# Altium schematic sheet Memory+GPIO.SchDoc
size A4; SheetNumber: 6; SheetTotal: 6
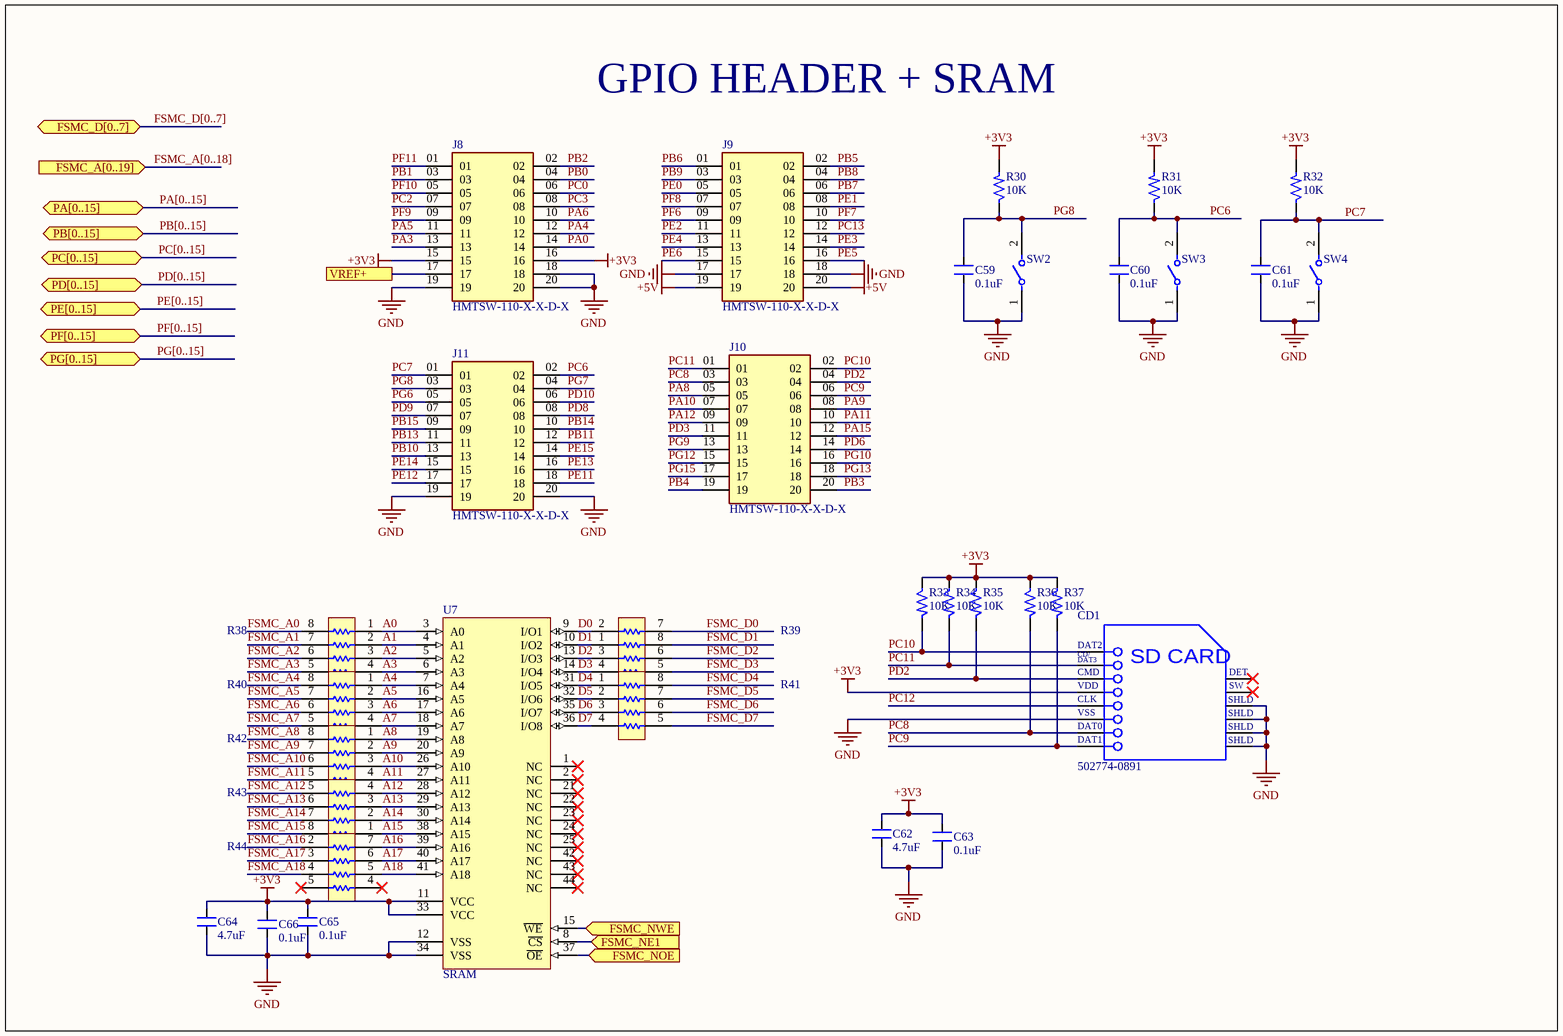
[diagram p0: Memory+GPIO.SchDoc]

## Parts
C59  0.1uF  [CAP_0805]
C60  0.1uF  [CAP_0805]
C61  0.1uF  [CAP_0805]
C62  4.7uF  [CAP_0805]
C63  0.1uF  [CAP_0805]
C64  4.7uF  [CAP_0805]
C65  0.1uF  [CAP_0805]
C66  0.1uF  [CAP_0805]
CD1  502774-0891  [MOLX-502774-0891_V]
J8  HMTSW-110-X-X-D-X  [SAMTEC_HMTSW-110-X-X-D-X]
J9  HMTSW-110-X-X-D-X  [SAMTEC_HMTSW-110-X-X-D-X]
J10  HMTSW-110-X-X-D-X  [SAMTEC_HMTSW-110-X-X-D-X]
J11  HMTSW-110-X-X-D-X  [SAMTEC_HMTSW-110-X-X-D-X]
R30  10K  [RES_0603]
R31  10K  [RES_0603]
R32  10K  [RES_0603]
R33  10K  [RES_0805]
R34  10K  [RES_0805]
R35  10K  [RES_0805]
R36  10K  [RES_0805]
R37  10K  [RES_0805]
R38  CAT16-103J4LF  [BOUR-CAT16-103J4LF_L]  (value not drawn)
R39  CAT16-103J4LF  [BOUR-CAT16-103J4LF_L]  (value not drawn)
R40  CAT16-103J4LF  [BOUR-CAT16-103J4LF_L]  (value not drawn)
R41  CAT16-103J4LF  [BOUR-CAT16-103J4LF_L]  (value not drawn)
R42  CAT16-103J4LF  [BOUR-CAT16-103J4LF_L]  (value not drawn)
R43  CAT16-103J4LF  [BOUR-CAT16-103J4LF_L]  (value not drawn)
R44  CAT16-103J4LF  [BOUR-CAT16-103J4LF_L]  (value not drawn)
SW2  147873-1  [FP-147873-1-MFG]  (value not drawn)
SW3  147873-1  [FP-147873-1-MFG]  (value not drawn)
SW4  147873-1  [FP-147873-1-MFG]  (value not drawn)
U7  SRAM  [CYP-TSOP-44_L]

## Ports
FSMC_A[0..19] (in, see MCU[3D]), FSMC_D[0..7] (bidir, see MCU[3D]), FSMC_NE1 (in, see MCU[2B]), FSMC_NOE (in, see MCU[2B]), FSMC_NWE (in, see MCU[2B]), PA[0..15] (bidir, see MCU[4D]), PB[0..15] (bidir, see MCU[4D]), PC[0..15] (bidir, see MCU[4D]), PD[0..15] (bidir, see MCU[4D]), PE[0..15] (bidir, see MCU[4D]), PF[0..15] (bidir, see MCU[4D]), PG[0..15] (bidir, see MCU[4D]), VREF+ (see MCU[3C])

## Nets
+3V3: C62.2 C63.2 C64.2 C65.2 C66.2 CD1.4(VDD) J8.15 J8.16 R30.2 R31.2 R32.2 R33.1 R34.1 R35.1 R36.1 R37.1 U7.11(VCC) U7.33(VCC)
+5V: J9.19 J9.20
GND: C59.1 C60.1 C61.1 C62.1 C63.1 C64.1 C65.1 C66.1 CD1.6(VSS) CD1.11(SHLD) CD1.12(SHLD) CD1.13(SHLD) CD1.14(SHLD) J8.18 J8.19 J8.20 J9.17 J9.18 J11.19 J11.20 SW2.1 SW3.1 SW4.1 U7.12(VSS) U7.34(VSS)
A0: R38.1 U7.3(A0)
A1: R38.2 U7.4(A1)
A2: R38.3 U7.5(A2)
A3: R38.4 U7.6(A3)
A4: R40.1 U7.7(A4)
A5: R40.2 U7.16(A5)
A6: R40.3 U7.17(A6)
A7: R40.4 U7.18(A7)
A8: R42.1 U7.19(A8)
A9: R42.2 U7.20(A9)
A10: R42.3 U7.26(A10)
A11: R42.4 U7.27(A11)
A12: R43.4 U7.28(A12)
A13: R43.3 U7.29(A13)
A14: R43.2 U7.30(A14)
A15: R43.1 U7.38(A15)
A16: R44.7 U7.39(A16)
A17: R44.6 U7.40(A17)
A18: R44.5 U7.41(A18)
D0: R39.2 U7.9(I/O1)
D1: R39.1 U7.10(I/O2)
D2: R39.3 U7.13(I/O3)
D3: R39.4 U7.14(I/O4)
D4: R41.1 U7.31(I/O5)
D5: R41.2 U7.32(I/O6)
D6: R41.3 U7.35(I/O7)
D7: R41.4 U7.36(I/O8)
FSMC_A0: R38.8
FSMC_A1: R38.7
FSMC_A2: R38.6
FSMC_A3: R38.5
FSMC_A4: R40.8
FSMC_A5: R40.7
FSMC_A6: R40.6
FSMC_A7: R40.5
FSMC_A8: R42.8
FSMC_A9: R42.7
FSMC_A10: R42.6
FSMC_A11: R42.5
FSMC_A12: R43.5
FSMC_A13: R43.6
FSMC_A14: R43.7
FSMC_A15: R43.8
FSMC_A16: R44.2
FSMC_A17: R44.3
FSMC_A18: R44.4
FSMC_D0: R39.7
FSMC_D1: R39.8
FSMC_D2: R39.6
FSMC_D3: R39.5
FSMC_D4: R41.8
FSMC_D5: R41.7
FSMC_D6: R41.6
FSMC_D7: R41.5
FSMC_NE1: U7.8(~{CS}) ; port FSMC_NE1
FSMC_NOE: U7.37(~{OE}) ; port FSMC_NOE
FSMC_NWE: U7.15(~{WE}) ; port FSMC_NWE
PA0: J8.14
PA3: J8.13
PA4: J8.12
PA5: J8.11
PA6: J8.10
PA8: J10.05
PA9: J10.08
PA10: J10.07
PA11: J10.10
PA12: J10.09
PA15: J10.12
PB0: J8.04
PB1: J8.03
PB2: J8.02
PB3: J10.20
PB4: J10.19
PB5: J9.02
PB6: J9.01
PB7: J9.06
PB8: J9.04
PB9: J9.03
PB10: J11.13
PB11: J11.12
PB13: J11.11
PB14: J11.10
PB15: J11.09
PC0: J8.06
PC2: J8.07
PC3: J8.08
PC6: C60.2 J11.02 R31.1 SW3.2
PC7: C61.2 J11.01 R32.1 SW4.2
PC8: CD1.7(DAT0) J10.03 R36.2
PC9: CD1.8(DAT1) J10.06 R37.2
PC10: CD1.1(DAT2) J10.02 R33.2
PC11: CD1.2(CD/DAT3) J10.01 R34.2
PC12: CD1.5(CLK)
PC13: J9.12
PD2: CD1.3(CMD) J10.04 R35.2
PD3: J10.11
PD6: J10.14
PD8: J11.08
PD9: J11.07
PD10: J11.06
PE0: J9.05
PE1: J9.08
PE2: J9.11
PE3: J9.14
PE4: J9.13
PE5: J9.16
PE6: J9.15
PE11: J11.18
PE12: J11.17
PE13: J11.16
PE14: J11.15
PE15: J11.14
PF6: J9.09
PF7: J9.10
PF8: J9.07
PF9: J8.09
PF10: J8.05
PF11: J8.01
PG6: J11.05
PG7: J11.04
PG8: C59.2 J11.03 R30.1 SW2.2
PG9: J10.13
PG10: J10.16
PG12: J10.15
PG13: J10.18
PG15: J10.17
VREF+: J8.17 ; port VREF+

Not connected (* = marked no-connect by the designer): CD1 9(DETECT)* 10(SWITCH)*; U7 1(NC)* 2(NC)* 21(NC)* 22(NC)* 23(NC)* 24(NC)* 25(NC)* 42(NC)* 43(NC)* 44(NC)*

## Buses and harness runs
bus FSMC_A[0..18] = port FSMC_A[0..19]
bus FSMC_D[0..7] = port FSMC_D[0..7]
bus PA[0..15] = port PA[0..15]
bus PB[0..15] = port PB[0..15]
bus PC[0..15] = port PC[0..15]
bus PD[0..15] = port PD[0..15]
bus PE[0..15] = port PE[0..15]
bus PF[0..15] = port PF[0..15]
bus PG[0..15] = port PG[0..15]

## Notes on the sheet
- GPIO HEADER + SRAM
- (in symbol CMP-2000-05248-1) CD/; DAT3; SD CARD; DET; SW

## Library data of the parts
C59-C61 C63 C65 C66 = CAP_0.1uF-50V-10%-0805: 0.1µF ±10% 50V Ceramic Capacitor X7R 0805 (2012 Metric); Manufacturer: Samsung; Manufacturer Part Number: CL21B104KBCNNNC; Alternate Part Number-1: NA; Case/Package: 0805; Supplier-1: SIRICOM; Supplier Part Number-1: 0805B104K500CT
C62 C64 = CAP_4.7uF-50V-10%-0805: 4.7µF ±10% 50V Ceramic Capacitor X5R 0805 (2012 Metric); Manufacturer: Yageo; Manufacturer Part Number: GRM21BR61H475KE51L; Alternate Part Number-1: NA; Case/Package: 0805; Supplier-1: SIRICOM; Supplier Part Number-1: CL21A475KBQNNNE
CD1 = CMP-2000-05248-1: Micro SD Memory Card Connector, 0.5 A, 10 V (DC), -25 to 85 degC, 8-Pin SMT, RoHS, Tape and Reel; Manufacturer: Molex; 3D Model: 502774-0891.stp; Online Catalog: microSD™Series; Number of Positions: 10(8+2); Card Type: SecureDigital-microSD™; Insertion, Removal Method: PushIn,PushOut; Other Names: WM24066DKR; Connector Type: ConnectorandEjector; Features: Switch; Family: MemoryConnectors-PCCardSockets; Manufacturer URL: http://www.molex.com/; Mounting Type: SurfaceMount,RightAngle; Contact Finish Thickness: 20µin(0.51µm); Standard Package: 1; Series: 502774; Ejector Side: -; Datasheet Version: Rev. D, 04/2004; Category: Connectors,Interconnects; Contact Finish: Gold; Datasheet URL: https://datasheet.ciiva.com/1104/1499551-1104671.pdf; RoHS Information: 502774-0891CertofCompliance; Mounting Feature: Reverse-Bottom; Packaging: Digi-Reel; Height Above Board: 0.071"(1.80mm); Catalog Drawings: 502774-0891
J8-J11 = HMTSW-110-X-X-D-X: HEADER, 20 CONTACTS, 2 ROWS, THROUGH HOLE, 2.54 MM; Connector Systems:Board-to-Board; Pitch Spacing:2.54mm; No. of Rows:2Rows; No. of Contacts:20Contacts; Contact Termination Type:Through Hole; Product Range:HMTSW Series RoHS Compliant: Yes; MF: Samtec; MP: HMTSW11008LMD330; SnapEDA_Link: https://www.snapeda.com/parts/HMTSW11008LMD330/Samtec/view-part/?ref=snap; Package: None; Value: *; Check_prices: https://www.snapeda.com/parts/HMTSW11008LMD330/Samtec/view-part/?ref=eda
R30-R32 = RES_10K-0.1W-1%-0603: 10 kOhms ±1% 0.1W, 1/10W Chip Resistor 0603 (1608 Metric) Automotive AEC-Q200 Thick Film; Manufacturer: Walsin; Manufacturer Part Number: WR06X1002FTL; Alternate Part Number-1: 0603WAJ0103T5E; Case/Package: 0603; Supplier-1: SIRICOM; Supplier Part Number-1: WR06X1002FTL
R33-R37 = RES_10K-0.125W-1%-0805: 10 kOhms ±1% 0.125W, 1/8W Chip Resistor 0805 (2012 Metric) Automotive AEC-Q200 Thick Film; Manufacturer: CTS; Manufacturer Part Number: WR08X1002FTL; Case/Package: 0805; Supplier-1: SIRICOM; Supplier Part Number-1: WR08X1002FTL; Alternate Part Number-1: WR08X1002FTL
R38-R44 = CMP-2000-06067-1: CAT / CAY 16 Series - Chip Resistor Array, 10 KOhm, +/- 5%, 50 V, -55 to 125 degC, 8-Pin SMD, RoHS, Tape and Reel; Manufacturer: Bourns; Power Per Element: 62.5mW; Online Catalog: CAT16Series; Resistance (Ohms): 10k; Number of Resistors: 4; EDA / CAD Models: DownloadfromAcceleratedDesigns; Temperature Coefficient: ±200ppm/°C; Circuit Type: Isolated; Other Names: CAT16-103J4LFDKR; Package Reference: CAT16-103J4LF; Datasheet Version: 09/2014; Series: CAT16; Manufacturer URL: http://www.bourns.com/; Mounting Type: SurfaceMount; Datasheet URL: http://www.mouser.com/ds/2/54/ATCAY-777361.pdf; Category: Resistors; Height: 0.024"(0.60mm); Mounting Technology: SurfaceMount; Applications: -; Size / Dimension: 0.126"Lx0.061"W(3.20mmx1.55mm); Packaging: Digi-Reel®; Package / Case: 1206(3216Metric),Concave,LongSideTerminals; Supplier Device Package: 1206; RoHS Information: CAT16MaterialDeclaration; Number of Pins: 8; Family: ResistorNetworks,Arrays; Standard Package: 1; Package Description: 8-Pin Surface Mount Device, Body 3.2 x 1.55 mm, Pitch 0.8 mm; Operating Temperature: -55°C~125°C; Tolerance: ±5%
SW2-SW4 = CMP-03407-000005-1: SWITCH TACTILE SPST-NO 0.05A 24V; Manufacturer: TE Connectivity; Contact Resistance: 100mΩ; Operating Force: 180gf; Electromechanical Life: 40000Cycles; Contact Current Rating: 50mA; Throw Configuration: SPST-NO; Mouser Description: Switch Tactile OFF (ON) SPST Rectangular Button J-Bend 0.05A 24VDC 1.77N SMD T/R; Mount: Surface Mount; Height: 5.5mm; Category: Switch; RoHS: TRUE; Temperature Range High: +85°C; ComponentLink2Description: Datasheet; Temperature Range Low: -35°C; Device Class L1: Electromechanical; Device Class L2: Switches; Package: 0; Temperature: -35°C to +85°C; Device Class L3: Tactile Switches; Automotive: No; Manufacturer Part Number: 147873-1; ComponentLink2URL: https://www.te.com/commerce/DocumentDelivery/DDEController?Action=showdoc&DocId=Customer+Drawing%7F147873%7FK3%7Fpdf%7FEnglish%7FENG_CD_147873_K3.pdf%7F147873-1; Lead Free: Yes; Voltage Rating Dc: 24V; Octopart: https://octopart.com/147873-1-te+connectivity-40818451; Digikey Description: SWITCH TACTILE SPST-NO 0.05A 24V
U7 = CMP-2000-06133-1: 4-Mbit (256 K x 16) Static RAM, 3 to 3.6 V, -40 to 85 degC, 44-Pin TSOP, RoHS, Tray; Manufacturer: Cypress; Sync/Async: Asynchronous; Clock Freq: NotRequiredMHz; Access Time (Max): 10ns; Number of Words: 256Kword; Rad Hardened: No; Operating Supply Voltage (Max): 3.6V; Number of Ports: 1; Word Size: 16b; Architecture: NotRequired; Density: 4194304Bit; Address Bus: 18b; Operating Supply Voltage (Typ): 3.3V; Supply Current: 90mA; Operating Supply Voltage (Min): 3V; Manufacturer URL: http://www.cypress.com/; Datasheet URL: http://www.cypress.com/file/42801/download; Operating Temp Range: -40Cto85C; Datasheet Version: Rev. *N, 12/2014; Access Time: 10ns; Package Type: TSOP-II; Package Description: 44-Pin Thin Small Outline Package, Body 18.415 x 10.16 mm, Pitch 0.8 mm; Operating Temperature Classification: Industrial; Mounting: SurfaceMount; Pin Count: 44; Clock Freq (Max): NotRequiredMHz; Packaging: Tray; Package Reference: TSOP-44; Mounting Technology: SurfaceMount